# Altium schematic sheet schematic.SchDoc
size A3
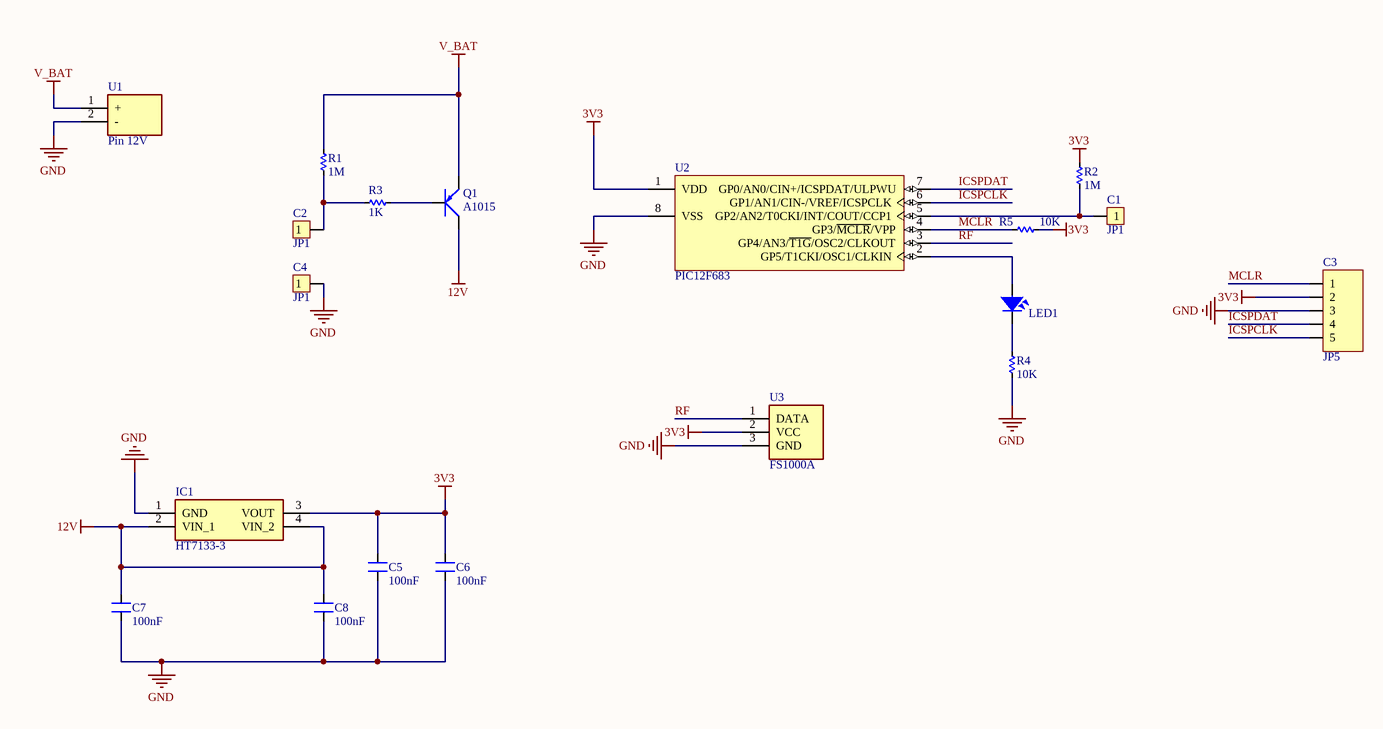
[diagram p0: schematic.SchDoc]

## Parts
C1  JP1  [JP1-D1T]
C2  JP1  [JP1-D1T]
C3  JP5  [JP5-D1T]
C4  JP1  [JP1-D1T]
C5  100nF  [CN-SMD-0603]
C6  100nF  [CN-SMD-0603]
C7  100nF  [CN-SMD-0603]
C8  100nF  [CN-SMD-0603]
IC1  HT7133-3  [AZ1117CR33TRG1]
LED1  LED  [LED-3MM-GREEN]  (value not drawn)
Q1  A1015  [SOT23B]
R1  1M  [RES-SMD-0603]
R2  1M  [RES-SMD-0603]
R3  1K  [RES-SMD-0603]
R4  10K  [RES-SMD-0603]
R5  10K  [RES-SMD-0603]
U1  Pin 12V  [pin_alkaline]
U2  PIC12F683  [SO8]
U3  FS1000A  [fs1000a]

## Nets
3V3: C3.2 C5.2 C6.2 IC1.3(VOUT) R2.1 R5.1 U2.1(VDD) U3.2(VCC)
12V: C7.2 C8.2 IC1.2(VIN_1) IC1.4(VIN_2) Q1.2(C)
GND: C3.3 C4.1 C5.1 C6.1 C7.1 C8.1 IC1.1(GND) R4.2 U1.2(-) U2.8(VSS) U3.3(GND)
V_BAT: Q1.1(E) R1.1 U1.1(+)
ICSPCLK: C3.5 U2.6(GP1/AN1/CIN-/VREF/ICSPCLK)
ICSPDAT: C3.4 U2.7(GP0/AN0/CIN+/ICSPDAT/ULPWU)
MCLR: C3.1 R5.2 U2.4(GP3/~{MCLR}/VPP)
RF: U2.3(GP4/AN3/~{T1G}/OSC2/CLKOUT) U3.1(DATA)
NetC1_1: C1.1 R2.2 U2.5(GP2/AN2/T0CKI/INT/COUT/CCP1)
NetC2_1: C2.1 R1.2 R3.1
NetLED1_1: LED1.1 U2.2(GP5/T1CKI/OSC1/CLKIN)
NetLED1_2: LED1.2 R4.1
NetQ1_3: Q1.3(B) R3.2

## Library data of the parts
C1 C2 C4 = JP1: WR-PHD 2.54 mm Angled Socket Header; Manufacturer: W¨¹rth Elektronik eiSos GmbH; partNo: 613002143121; ComponentLink1 Description: Manufacturer; ComponentLink2 Description: Datasheet; NoPins: 02; Created Date: 29 March 2013; ComponentLink1URL: http://www.we-online.com; ComponentLink2URL: http://katalog.we-online.de/em/datasheet/6130xx143121.pdf; Created by: Karrer Zheng
C3 = JP5: WR-PHD 2.54 mm Angled Socket Header; Manufacturer: W¨¹rth Elektronik eiSos GmbH; partNo: 613005143121; ComponentLink1 Description: Manufacturer; ComponentLink2 Description: Datasheet; NoPins: 05; Created Date: 29 March 2013; ComponentLink1URL: http://www.we-online.com; ComponentLink2URL: http://katalog.we-online.de/em/datasheet/6130xx143121.pdf; Created by: Karrer Zheng
C5-C8 = CN: Value: 33pF
IC1 = AP2204RA-5.0TRG1: Integrated Circuit; Manufacturer_Name: Diodes Inc.; Datasheet Link: https://datasheet.datasheetarchive.com/originals/distributors/Datasheets_SAMA/5d52b656135dbfe7dbe35c76df69cd37.pdf; Height: 2mm; Manufacturer_Part_Number: AP2204RA-5.0TRG1; Mouser Part Number: 621-AP2204RA-5.0TRG1; Mouser Price/Stock: https://www.mouser.co.uk/ProductDetail/Diodes-Incorporated/AP2204RA-5.0TRG1?qs=x6A8l6qLYDBPMMLBh4icCw%3D%3D; Arrow Part Number: AP2204RA-5.0TRG1; Arrow Price/Stock: https://www.arrow.com/en/products/ap2204ra-5.0trg1/diodes-incorporated?region=nac
LED1 = LED: LED Single colour Green and Red; Value: LED 3 ly Single Colour
Q1 = A1015: PNP 600mW, ECB; Value: A1015
R1-R5 = Res-SMD: Resistor; Manufacturer: Generic Components; Class: Passive; Published: 08/06/2000; Publisher: Altium Hobart Technology Centre
U1 = Pin Alkaline 12V
U2 = PIC12F683: Supplier 1: Mouser